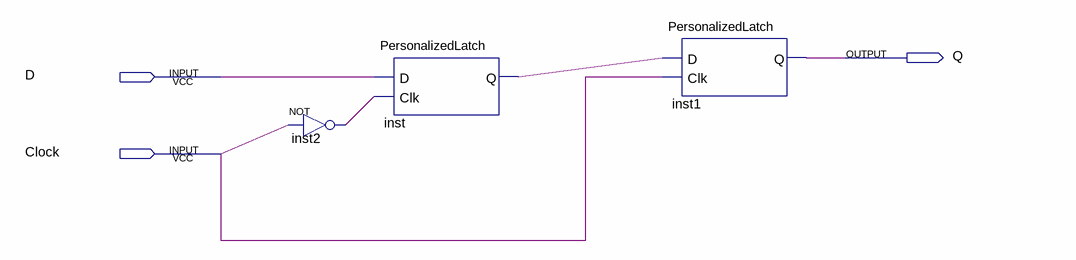
[diagram p0: schematic sheet]
// Quartus schematic PositiveEdgeFlipFlop.bdf as structural Verilog: 3 symbols, 3 pins
module PositiveEdgeFlipFlop (
  input  D,
  input  Clock,
  output Q
);

  wire inst2_out, inst_q;

  not inst2 (inst2_out, Clock);
  PersonalizedLatch inst (.D(D), .Clk(inst2_out), .Q(inst_q));
  PersonalizedLatch inst1 (.D(inst_q), .Clk(Clock), .Q(Q));
endmodule
